# EAGLE schematic schaltplan (EAGLE 6.4)
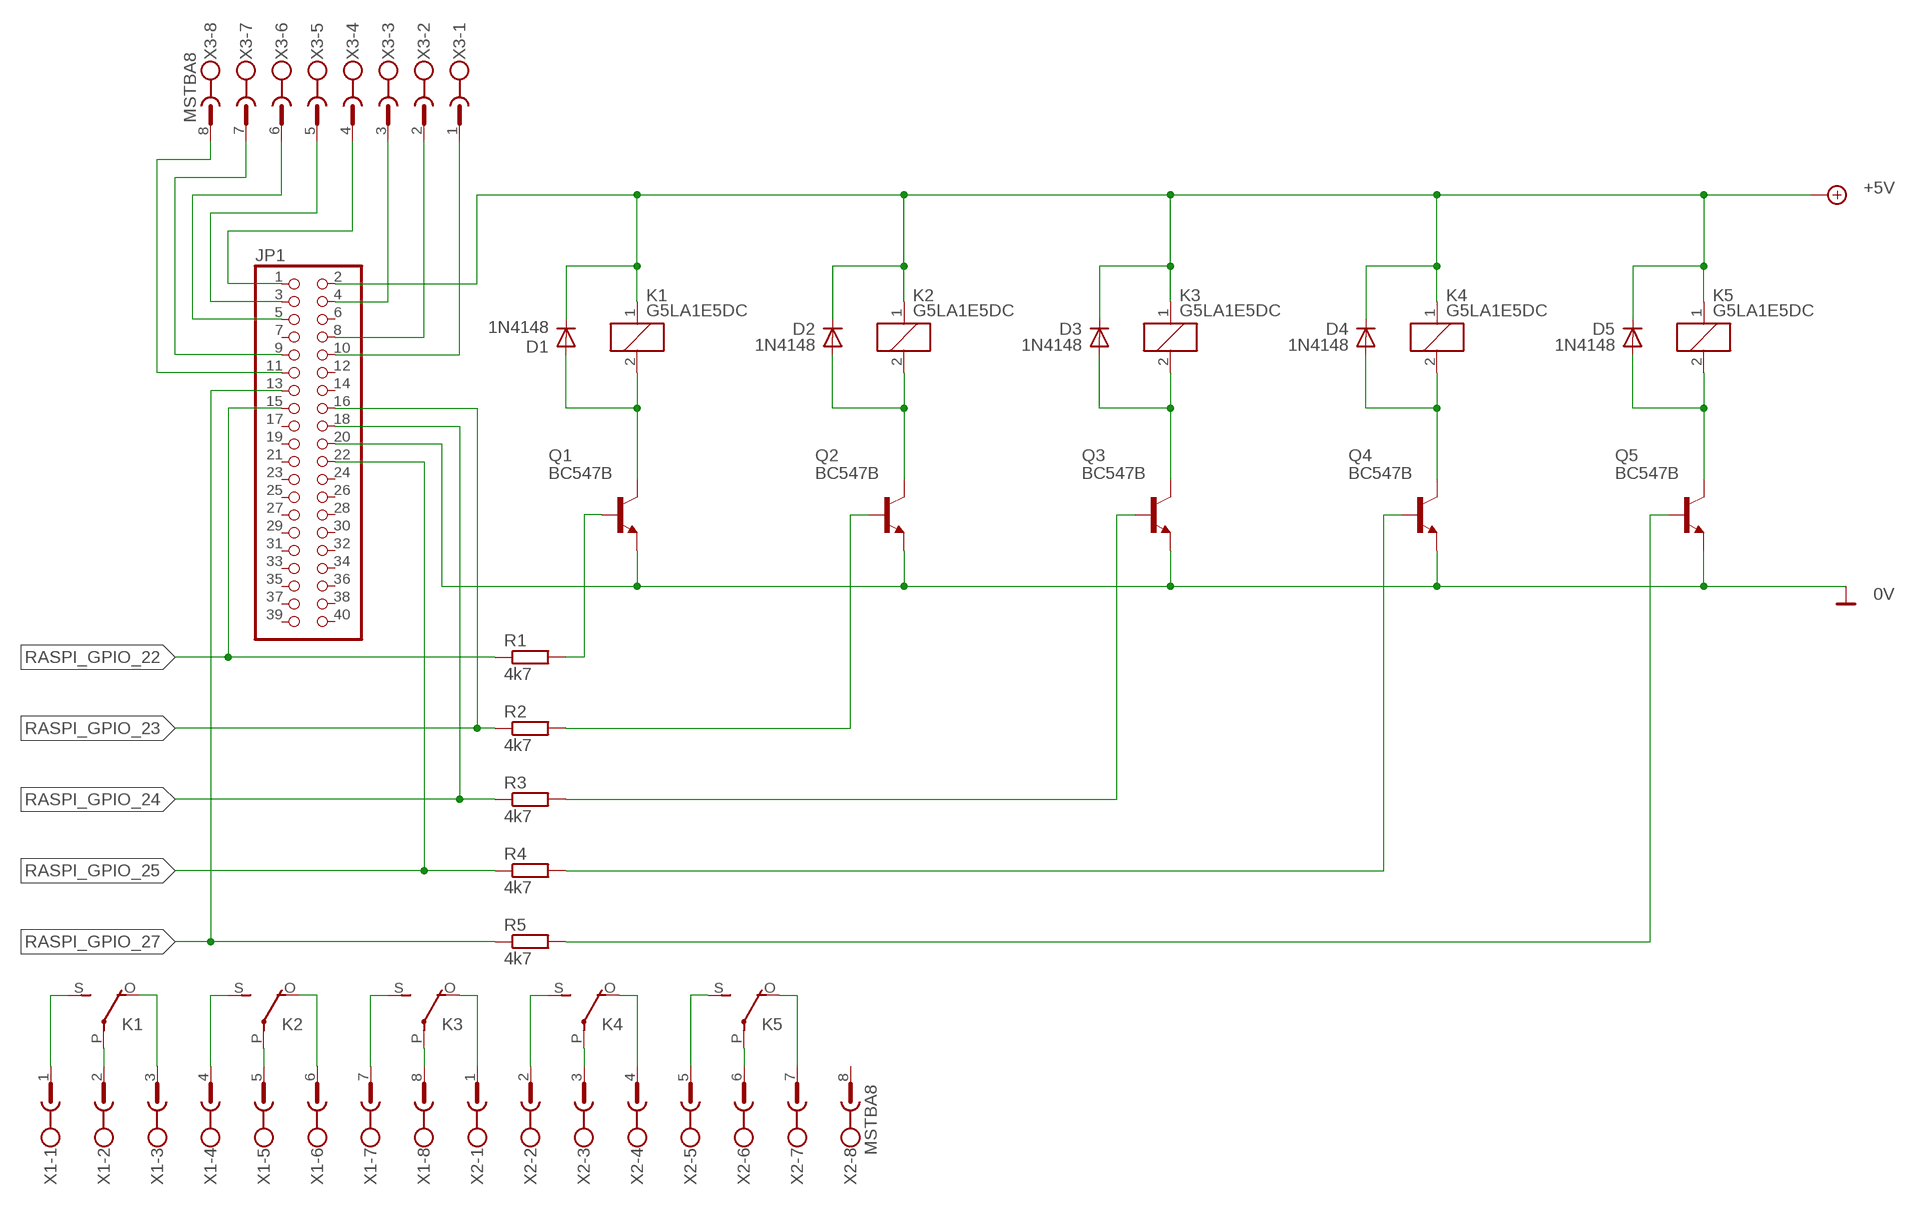
[diagram p0: schematic, sheet 1]

## Parts
D1  1N4148  1N4148DO35-10  [DO35-10]
D2  1N4148  1N4148DO35-10  [DO35-10]
D3  1N4148  1N4148DO35-10  [DO35-10]
D4  1N4148  1N4148DO35-10  [DO35-10]
D5  1N4148  1N4148DO35-10  [DO35-10]
JP1  PINHD-2X20  [2X20]
K1  G5LA1E5DC  G5L  [G5LE]
K2  G5LA1E5DC  G5L  [G5LE]
K3  G5LA1E5DC  G5L  [G5LE]
K4  G5LA1E5DC  G5L  [G5LE]
K5  G5LA1E5DC  G5L  [G5LE]
Q1  BC547B  [TO92]
Q2  BC547B  [TO92]
Q3  BC547B  [TO92]
Q4  BC547B  [TO92]
Q5  BC547B  [TO92]
R1  4k7  R-EU_0207/10  [0207/10]
R2  4k7  R-EU_0207/10  [0207/10]
R3  4k7  R-EU_0207/10  [0207/10]
R4  4k7  R-EU_0207/10  [0207/10]
R5  4k7  R-EU_0207/10  [0207/10]
X1  MSTBA8  [MSTBA8]
X2  MSTBA8  [MSTBA8]
X3  MSTBA8  [MSTBA8]

## Nets
0V: JP1.20 Q1.1(E) Q2.1(E) Q3.1(E) Q4.1(E) Q5.1(E)
+5V: D1.C D2.C D3.C D4.C D5.C JP1.2 K1.1 K2.1 K3.1 K4.1 K5.1
N$1: D1.A K1.2 Q1.3(C)
N$2: D2.A K2.2 Q2.3(C)
N$3: D3.A K3.2 Q3.3(C)
N$4: D4.A K4.2 Q4.3(C)
N$5: D5.A K5.2 Q5.3(C)
N$6: JP1.10 X3.1
N$7: Q2.2(B) R2.2
N$8: Q3.2(B) R3.2
N$9: Q4.2(B) R4.2
N$10: Q5.2(B) R5.2
N$11: K4.P(2:P) X2.3
N$12: K1.P(2:P) X1.2
N$13: K1.O(2:O) X1.3
N$14: K1.S(2:S) X1.1
N$15: K2.P(2:P) X1.5
N$16: K2.O(2:O) X1.6
N$17: K2.S(2:S) X1.4
N$18: K3.P(2:P) X1.8
N$19: K3.O(2:O) X2.1
N$20: K3.S(2:S) X1.7
N$21: K4.O(2:O) X2.4
N$22: K4.S(2:S) X2.2
N$23: K5.P(2:P) X2.6
N$24: K5.S(2:S) X2.5
N$25: K5.O(2:O) X2.7
N$26: Q1.2(B) R1.2
N$27: JP1.8 X3.2
N$28: JP1.4 X3.3
N$29: JP1.1 X3.4
N$30: JP1.3 X3.5
N$31: JP1.5 X3.6
N$32: JP1.9 X3.7
N$33: JP1.11 X3.8
RASPI_GPIO_22: JP1.15 R1.1
RASPI_GPIO_23: JP1.16 R2.1
RASPI_GPIO_24: JP1.18 R3.1
RASPI_GPIO_25: JP1.22 R4.1
RASPI_GPIO_27: JP1.13 R5.1
Unconnected: JP1.6 JP1.7 JP1.12 JP1.14 JP1.17 JP1.19 JP1.21 JP1.23 JP1.24 JP1.25 JP1.26 JP1.27 JP1.28 JP1.29 JP1.30 JP1.31 JP1.32 JP1.33 JP1.34 JP1.35 JP1.36 JP1.37 JP1.38 JP1.39 JP1.40 X2.8

## Library data of the parts
D1-D5 = diode:1N4148: DIODE high speed (Philips)
JP1 = pinhead:PINHD-2X20: PIN HEADER
K1-K5 = relay:G5L: RELAY 1 x switch, 10 A/120 V AC, 8 A/30 V ADC, Omron; OC_FARNELL: unknown; OC_NEWARK: unknown
Q1-Q5 = transistor-npn:BC547*: NPN Transistor
R1-R5 = rcl:R-EU_: RESISTOR, European symbol
X1-X3 = con-phoenix-508:MSTBA8: PHOENIX; MF: FARNELL; MPN: 1757307; OC_FARNELL: 3705225; OC_NEWARK: 71C4166